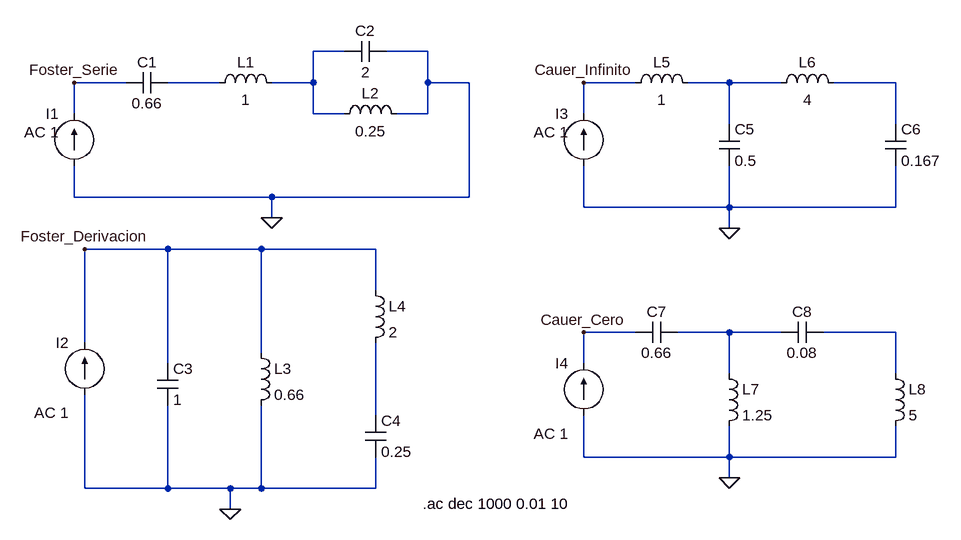
[diagram p0: schematic Circuitos.asc]
Circuitos.asc, the LTspice schematic file:
Version 4.1
SHEET 1 964 680
WIRE -48 -144 -96 -144
WIRE 80 -144 16 -144
WIRE -384 -96 -464 -96
WIRE -240 -96 -320 -96
WIRE -96 -96 -96 -144
WIRE -96 -96 -160 -96
WIRE 80 -96 80 -144
WIRE 144 -96 80 -96
WIRE 400 -96 320 -96
WIRE 544 -96 480 -96
WIRE 624 -96 544 -96
WIRE 800 -96 704 -96
WIRE -464 -48 -464 -96
WIRE -96 -48 -96 -96
WIRE -48 -48 -96 -48
WIRE 80 -48 80 -96
WIRE 80 -48 32 -48
WIRE 320 -48 320 -96
WIRE 544 -32 544 -96
WIRE 800 -32 800 -96
WIRE -464 80 -464 32
WIRE -160 80 -464 80
WIRE 144 80 144 -96
WIRE 144 80 -160 80
WIRE 320 96 320 32
WIRE 544 96 544 32
WIRE 544 96 320 96
WIRE 800 96 800 32
WIRE 800 96 544 96
WIRE -160 112 -160 80
WIRE 544 128 544 96
WIRE -320 160 -448 160
WIRE -176 160 -320 160
WIRE 0 160 -176 160
WIRE 0 224 0 160
WIRE 400 288 320 288
WIRE 544 288 464 288
WIRE 624 288 544 288
WIRE 800 288 688 288
WIRE -448 304 -448 160
WIRE -176 320 -176 160
WIRE -320 336 -320 160
WIRE 320 336 320 288
WIRE 544 352 544 288
WIRE 800 352 800 288
WIRE 0 416 0 304
WIRE 320 480 320 416
WIRE 544 480 544 432
WIRE 544 480 320 480
WIRE 800 480 800 432
WIRE 800 480 544 480
WIRE 544 512 544 480
WIRE -448 528 -448 384
WIRE -320 528 -320 400
WIRE -320 528 -448 528
WIRE -224 528 -320 528
WIRE -176 528 -176 400
WIRE -176 528 -224 528
WIRE 0 528 0 480
WIRE 0 528 -176 528
WIRE -224 560 -224 528
FLAG -160 112 0
FLAG -224 560 0
FLAG 544 512 0
FLAG 544 128 0
FLAG -464 -96 Foster_Serie
FLAG 320 -96 Cauer_Infinito
FLAG -448 160 Foster_Derivacion
FLAG 320 288 Cauer_Cero
SYMBOL cap -320 -112 R90
WINDOW 0 0 32 VBottom 2
WINDOW 3 32 32 VTop 2
SYMATTR InstName C1
SYMATTR Value 0.66
SYMBOL cap 16 -160 R90
WINDOW 0 0 32 VBottom 2
WINDOW 3 32 32 VTop 2
SYMATTR InstName C2
SYMATTR Value 2
SYMBOL ind -256 -80 R270
WINDOW 0 32 56 VTop 2
WINDOW 3 5 56 VBottom 2
SYMATTR InstName L1
SYMATTR Value 1
SYMATTR SpiceLine Rser=1m
SYMBOL ind -64 -32 R270
WINDOW 0 32 56 VTop 2
WINDOW 3 5 56 VBottom 2
SYMATTR InstName L2
SYMATTR Value 0.25
SYMATTR SpiceLine Rser=1m
SYMBOL current -464 32 R180
WINDOW 0 24 80 Left 2
WINDOW 3 24 0 Left 2
WINDOW 123 24 52 Left 2
WINDOW 39 0 0 Left 0
SYMATTR InstName I1
SYMATTR Value ""
SYMATTR Value2 AC 1
SYMBOL cap -336 336 R0
SYMATTR InstName C3
SYMATTR Value 1
SYMBOL ind -192 304 R0
SYMATTR InstName L3
SYMATTR Value 0.66
SYMATTR SpiceLine Rser=1m
SYMBOL ind -16 208 R0
SYMATTR InstName L4
SYMATTR Value 2
SYMATTR SpiceLine Rser=1m
SYMBOL cap -16 416 R0
SYMATTR InstName C4
SYMATTR Value 0.25
SYMBOL current -448 384 R180
WINDOW 0 24 80 Left 2
WINDOW 3 24 0 Left 2
WINDOW 123 24 -28 Left 2
WINDOW 39 0 0 Left 0
SYMATTR InstName I2
SYMATTR Value ""
SYMATTR Value2 AC 1
SYMBOL current 320 32 R180
WINDOW 0 24 80 Left 2
WINDOW 3 24 0 Left 2
WINDOW 123 24 52 Left 2
WINDOW 39 0 0 Left 0
SYMATTR InstName I3
SYMATTR Value ""
SYMATTR Value2 AC 1
SYMBOL current 320 416 R180
WINDOW 0 24 80 Left 2
WINDOW 3 24 0 Left 2
WINDOW 123 24 -28 Left 2
WINDOW 39 0 0 Left 0
SYMATTR InstName I4
SYMATTR Value ""
SYMATTR Value2 AC 1
SYMBOL ind 384 -80 R270
WINDOW 0 32 56 VTop 2
WINDOW 3 5 56 VBottom 2
SYMATTR InstName L5
SYMATTR Value 1
SYMATTR SpiceLine Rser=1m
SYMBOL ind 608 -80 R270
WINDOW 0 32 56 VTop 2
WINDOW 3 5 56 VBottom 2
SYMATTR InstName L6
SYMATTR Value 4
SYMATTR SpiceLine Rser=1m
SYMBOL ind 528 336 R0
SYMATTR InstName L7
SYMATTR Value 1.25
SYMATTR SpiceLine Rser=1m
SYMBOL ind 784 336 R0
SYMATTR InstName L8
SYMATTR Value 5
SYMATTR SpiceLine Rser=1m
SYMBOL cap 528 -32 R0
SYMATTR InstName C5
SYMATTR Value 0.5
SYMBOL cap 784 -32 R0
SYMATTR InstName C6
SYMATTR Value 0.167
SYMBOL cap 464 272 R90
WINDOW 0 0 32 VBottom 2
WINDOW 3 32 32 VTop 2
SYMATTR InstName C7
SYMATTR Value 0.66
SYMBOL cap 688 272 R90
WINDOW 0 0 32 VBottom 2
WINDOW 3 32 32 VTop 2
SYMATTR InstName C8
SYMATTR Value 0.08
TEXT 72 552 Left 2 !.ac dec 1000 0.01 10

The netlist it stands for:
* Circuitos.asc
C1 N002 Foster_Serie 0.66
C2 0 N001 2
L1 N002 N001 1 Rser=1m
L2 N001 0 0.25 Rser=1m
I1 0 Foster_Serie AC 1
C3 Foster_Derivacion 0 1
L3 Foster_Derivacion 0 0.66 Rser=1m
L4 Foster_Derivacion N007 2 Rser=1m
C4 N007 0 0.25
I2 0 Foster_Derivacion AC 1
I3 0 Cauer_Infinito AC 1
I4 0 Cauer_Cero AC 1
L5 Cauer_Infinito N003 1 Rser=1m
L6 N003 N004 4 Rser=1m
L7 N005 0 1.25 Rser=1m
L8 N006 0 5 Rser=1m
C5 N003 0 0.5
C6 N004 0 0.167
C7 N005 Cauer_Cero 0.66
C8 N006 N005 0.08
.ac dec 1000 0.01 10
.backanno
.end

* Results of the author's LTspice run, read from the files saved beside the schematic
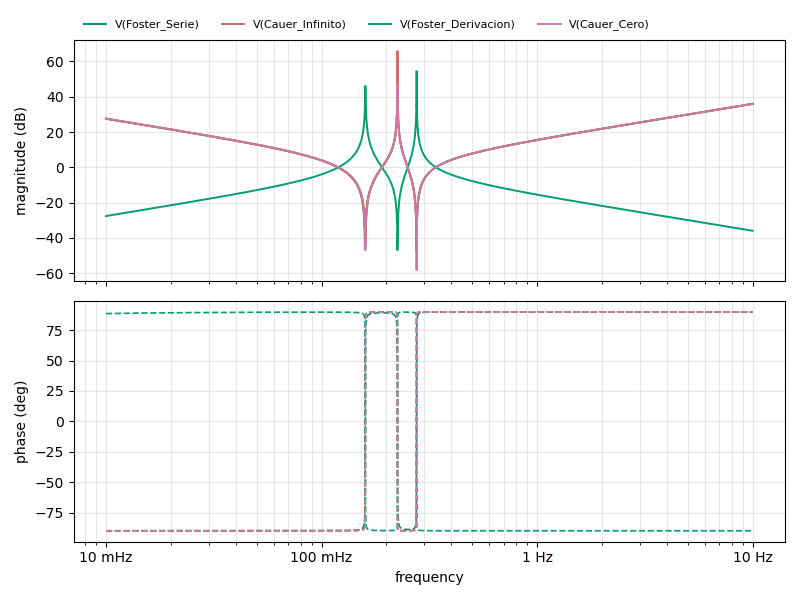
[diagram p1: AC Analysis of Circuitos.asc, plotted from the saved traces]
* AC Analysis, 1 run:
*   V(Foster_Serie): 27.62 dB at 10 mHz, 35.96 dB at 10 Hz, peak 40.82 dB at 224.9 mHz, 3 dB below the peak at 224.7 mHz and 225.5 mHz
*   V(Cauer_Infinito): 27.53 dB at 10 mHz, 35.96 dB at 10 Hz, peak 65.76 dB at 224.9 mHz, 3 dB below the peak at 224.8 mHz and 225 mHz
*   V(Foster_Derivacion): -27.61 dB at 10 mHz, -35.96 dB at 10 Hz, peak 54.59 dB at 276.1 mHz, 3 dB below the peak at 276 mHz and 276.2 mHz
*   V(Cauer_Cero): 27.62 dB at 10 mHz, 35.96 dB at 10 Hz, peak 47.12 dB at 224.9 mHz, 3 dB below the peak at 224.8 mHz and 225.2 mHz